# Altium schematic sheet A-Power.SchDoc: Power
size A3; SheetNumber: 03; SheetTotal: 03
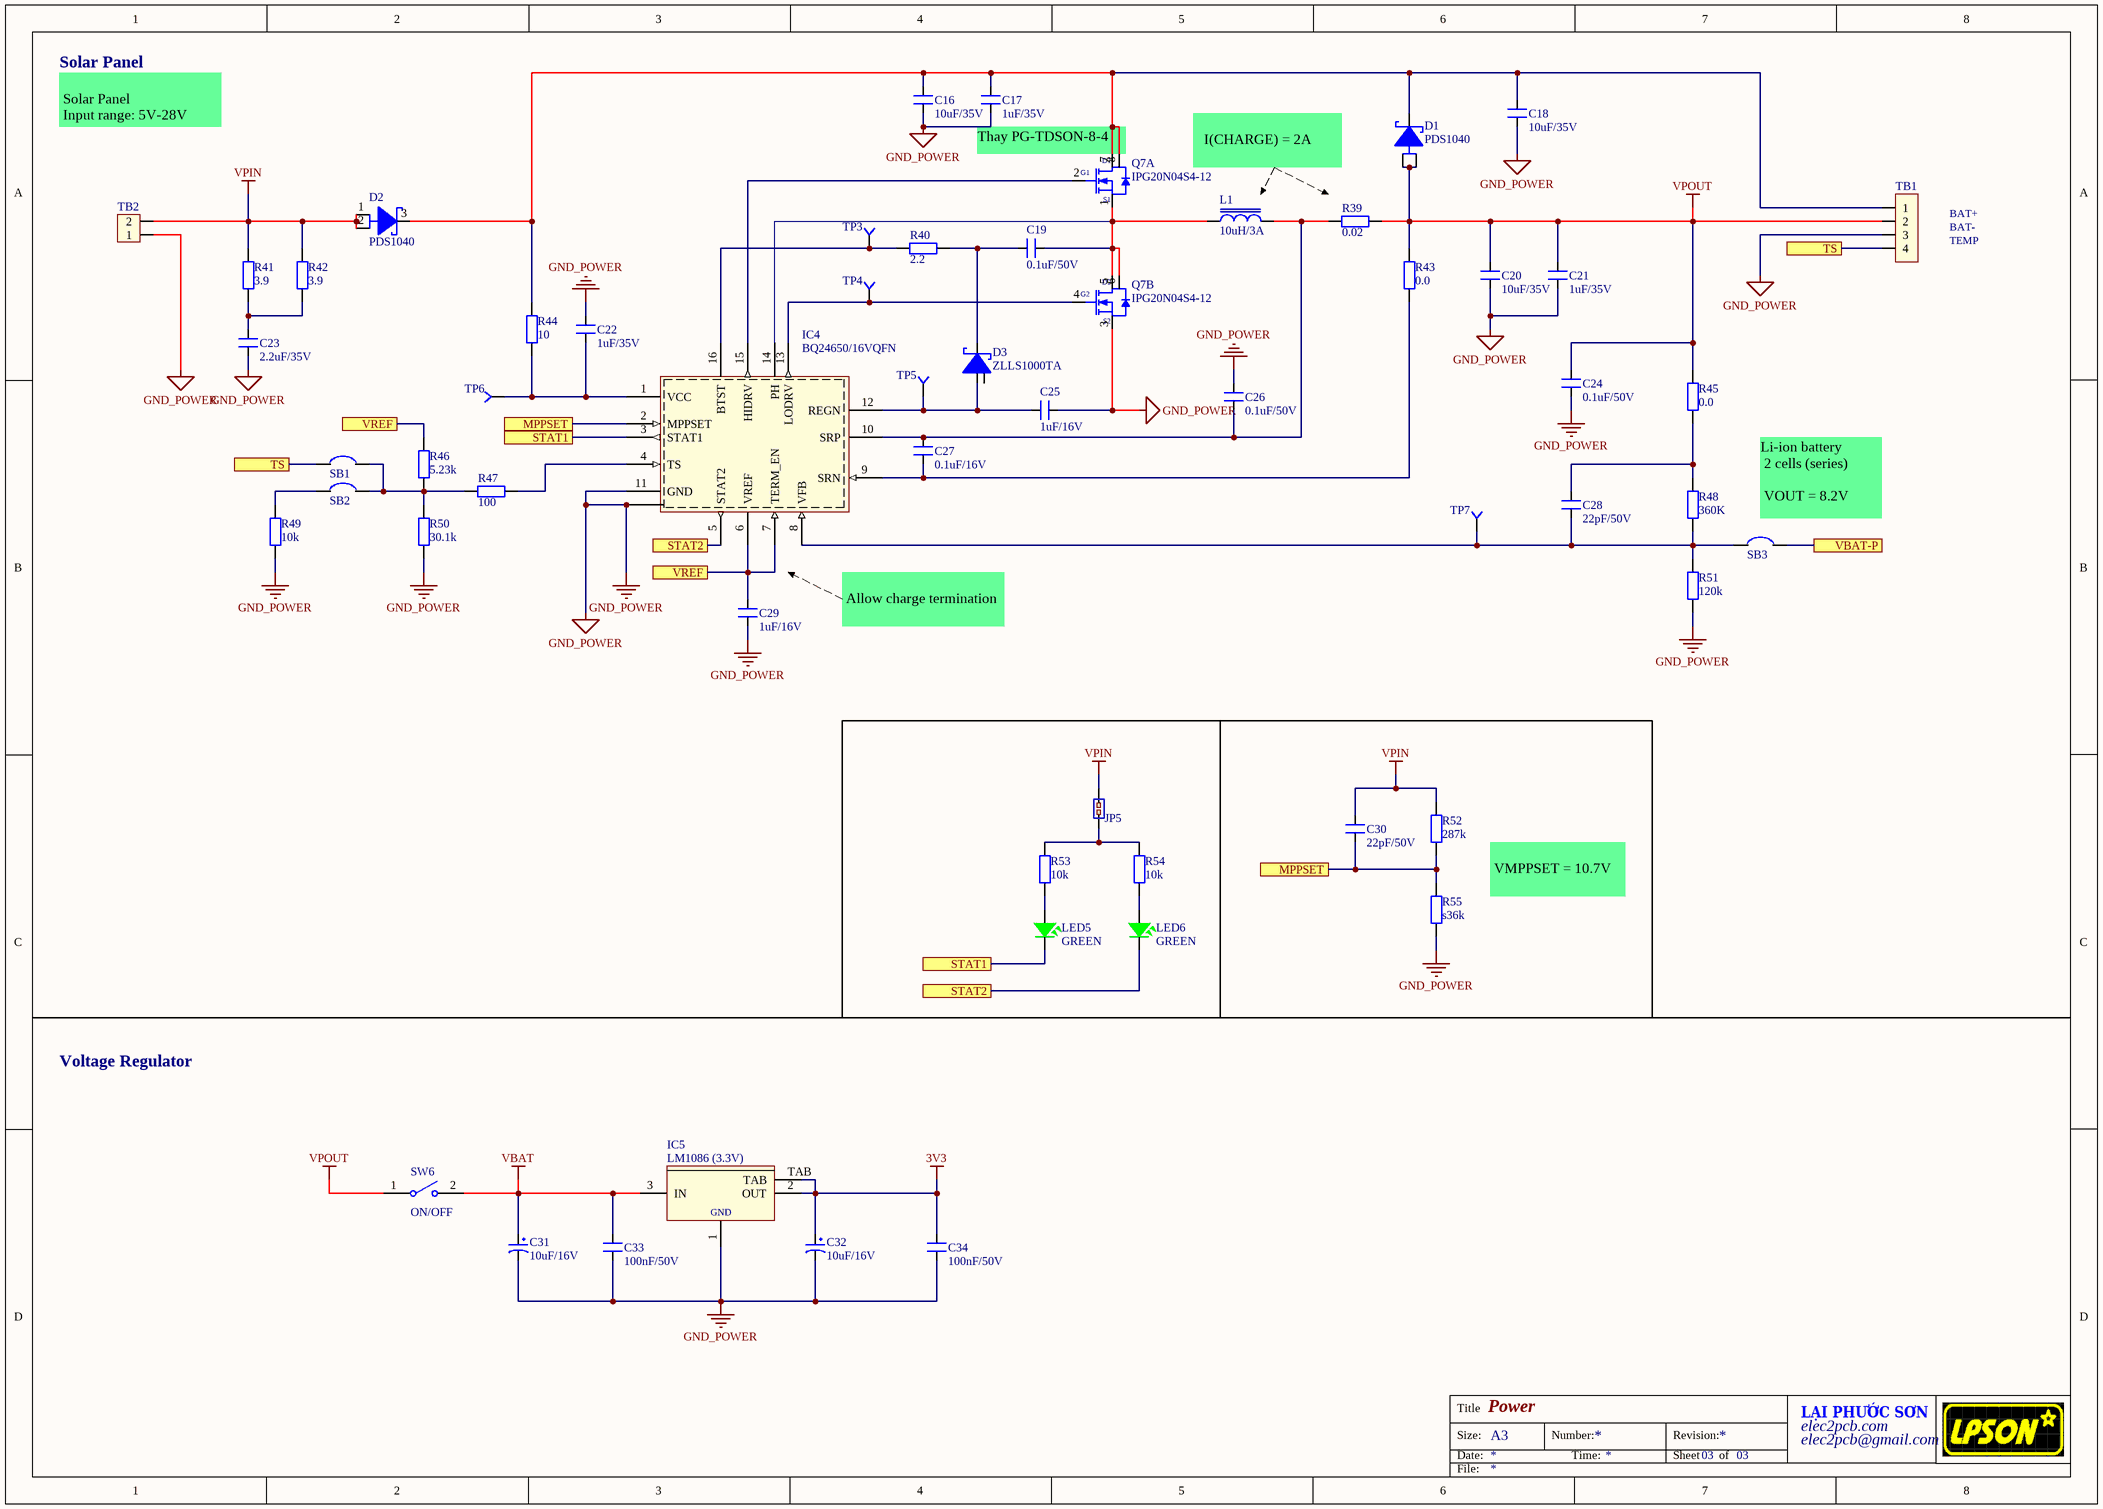
[diagram p0: A-Power.SchDoc]

## Parts
C16  10uF/35V  [CAP_CERA_C3216(CC1206INCH)]
C17  1uF/35V  [CAP_CERA_C2012(CC0805INCH)]
C18  10uF/35V  [CAP_CERA_C3216(CC1206INCH)]
C19  0.1uF/50V  [CAP_CERA_C1608(CC0603INCH)]
C20  10uF/35V  [CAP_CERA_C3216(CC1206INCH)]
C21  1uF/35V  [CAP_CERA_C2012(CC0805INCH)]
C22  1uF/35V  [CAP_CERA_C2012(CC0805INCH)]
C23  2.2uF/35V  [CAP_CERA_C3225(CC1210)]
C24  0.1uF/50V  [CAP_CERA_C1608(CC0603INCH)]
C25  1uF/16V  [CAP_CERA_C2012(CC0805INCH)]
C26  0.1uF/50V  [CAP_CERA_C1608(CC0603INCH)]
C27  0.1uF/16V  [CAP_CERA_C1608(CC0603INCH)]
C28  22pF/50V  [CAP_CERA_C1608(CC0603INCH)]
C29  1uF/16V  [CAP_CERA_C2012(CC0805INCH)]
C30  22pF/50V  [CAP_CERA_C1608(CC0603INCH)]
C31  10uF/16V  [CAP_CERA_C3216(CC1206INCH)]
C32  10uF/16V  [CAP_CERA_C3216(CC1206INCH)]
C33  100nF/50V  [CAP_CERA_C2012(CC0805INCH)]
C34  100nF/50V  [CAP_CERA_C2012(CC0805INCH)]
D1  PDS1040  [PDS1040]
D2  PDS1040  [PDS1040]
D3  ZLLS1000TA  [ZLLS1000]
IC4  BQ24650/16VQFN  [BQ24650-16VQFN]
IC5  LM1086 (3.3V)  [LM1086]
JP5  JP2-ShortingJumper  [Header_2]  (value not drawn)
L1  10uH/3A  [IHLP-2525CZ-01]
LED5  GREEN  [Led 0805G]
LED6  GREEN  [Led 0805G]
Q7  IPG20N04S4-12  [PG-TDSON-8-4]  (parts A,B of 2)
R39  Resistance (Ohms): 0.02  [RES-1206-3216MM]
R40  Resistance (Ohms): 2.2  [RESC2012(0805)]
R41  Resistance (Ohms): 3.9  [RES-1206-3216MM]
R42  Resistance (Ohms): 3.9  [RES-1206-3216MM]
R43  Resistance (Ohms): 0.0  [RESC2012(0805)]
R44  Resistance (Ohms): 10  [RESC2012(0805)]
R45  Resistance (Ohms): 0.0  [RESC2012(0805)]
R46  Resistance (Ohms): 5.23k  [RESC2012(0805)]
R47  Resistance (Ohms): 100  [RESC2012(0805)]
R48  360K  [RESC2012(0805)]
R49  Resistance (Ohms): 10k  [RESC2012(0805)]
R50  Resistance (Ohms): 30.1k  [RESC2012(0805)]
R51  Resistance (Ohms): 120k  [RESC2012(0805)]
R52  Resistance (Ohms): 287k  [RESC2012(0805)]
R53  Resistance (Ohms): 10k  [RESC2012(0805)]
R54  Resistance (Ohms): 10k  [RESC2012(0805)]
R55  Resistance (Ohms): s36k  [RESC2012(0805)]
SB1  Connect  [head PAD]  (value not drawn)
SB2  Connect  [head PAD]  (value not drawn)
SB3  Connect  [head PAD]  (value not drawn)
SW6  ON/OFF  [SW-POWER]
TB1  TERM BLOCK  [MKDS-DOMINO-4-PIN]  (value not drawn)
TB2  TERM BLOCK  [MKDS-DOMINO-2-PIN]  (value not drawn)
TP3  Test Point  [Test_point_VIA06]  (value not drawn)
TP4  Test Point  [Test_point_VIA06]  (value not drawn)
TP5  Test Point  [Test_point_VIA06]  (value not drawn)
TP6  Test Point  [Test_point_VIA06]  (value not drawn)
TP7  Test Point  [Test_point_VIA06]  (value not drawn)

## Ports
MPPSET, STAT1, STAT2, TS, VBAT-P, VREF

## Nets
3V3: C32.1 C34.1 IC5.2(OUT) IC5.TAB
GND_POWER: C16.2 C17.2 C18.2 C20.2 C21.2 C22.2 C23.2 C24.1 C25.1 C26.2 C29.1 C31.2 C32.2 C33.2 C34.2 IC4.11(GND) IC4.PAD IC5.1(GND) Q7.3(S2) R49.2 R50.2 R51.2 R55.1 TB1.3 TB2.1
VBAT: C31.1 C33.1 IC5.3(IN) SW6.2
VPIN: C30.1 D2.1(A1) D2.2(A2) JP5.2 R41.1 R42.1 R52.1 TB2.2
VPOUT: C20.1 C21.1 C24.2 D1.1(A1) D1.2(A2) R39.2 R43.1 R45.1 SW6.1 TB1.2
MPPSET: C30.2 IC4.2(MPPSET) R52.2 R55.2 ; port MPPSET
STAT1: IC4.3(STAT1) LED5.2(K) ; port STAT1
STAT2: IC4.5(STAT2) LED6.2(K) ; port STAT2
TS: SB1.2 TB1.4 ; port TS
VBAT-P: SB3.1 ; port VBAT-P
VREF: C29.2 IC4.6(VREF) IC4.7(TERM_EN) R46.1 ; port VREF
NetC16_1: C16.1 C17.1 C18.1 D1.3(K) D2.3(K) Q7.7(D1) Q7.8(D1) R44.1 TB1.1
NetC19_1: C19.1 D3.3(K) R40.2
NetC19_2: C19.2 IC4.14(PH) L1.1 Q7.1(S1) Q7.5(D2) Q7.6(D2)
NetC22_1: C22.1 IC4.1(VCC) R44.2 TP6.1
NetC23_1: C23.1 R41.2 R42.2
NetC25_2: C25.2 D3.1(A) IC4.12(REGN) TP5.1
NetC26_1: C26.1 C27.1 IC4.10(SRP) L1.2 R39.1
NetC27_2: C27.2 IC4.9(SRN) R43.2
NetC28_1: C28.1 R45.2 R48.2
NetC28_2: C28.2 IC4.8(VFB) R48.1 R51.1 SB3.2 TP7.1
NetIC4_4: IC4.4(TS) R47.2
NetIC4_13: IC4.13(LODRV) Q7.4(G2) TP4.1
NetIC4_15: IC4.15(HIDRV) Q7.2(G1)
NetIC4_16: IC4.16(BTST) R40.1 TP3.1
NetJP5_1: JP5.1 R53.1 R54.1
NetLED5_1: LED5.1(A) R53.2
NetLED6_1: LED6.1(A) R54.2
NetR46_2: R46.2 R47.1 R50.1 SB1.1 SB2.1
NetR49_1: R49.1 SB2.2

Not connected (* = marked no-connect by the designer): D3 NC

## Notes on the sheet
- Solar Panel
- Solar Panel
  Input range: 5V-28V
- Thay PG-TDSON-8-4
- I(CHARGE) = 2A
- BAT+
- BAT-
- TEMP
- (near SB3) Li-ion battery
  2 cells (series)
  VOUT = 8.2V
- Allow charge termination
- VMPPSET = 10.7V
- Voltage Regulator
- Title
- Size:
- Date:
- A3
- Number:
- Time:
- Revision:
- Sheet
- of
- LẠI PHƯỚC SƠN
- elec2pcb@gmail.com
- elec2pcb.com
- File:

## Library data of the parts
C16 C18 C20 = CAP-CER/10uF/35V/X7R-1206: CAP CER 10UF 35V X7R 1206; Manufacturer: Taiyo Yuden; Manufacturer Part Number: GMK316AB7106KL-TR; Capacitance: 10µF; Tolerance: ±10%; Supplier 1: Digi-Key; RoHS: RoHS Compliant; Category: Capacitors; Stock 1: 110595; Pricing 1: 1=0.59, 10=0.49, 50=0.3514, 100=0.3074, 250=0.24156, 500=0.2196, 1000=0.17568 (USD); Packaging: Cut Tape (CT); Voltage - Rated: 35V; Temperature Coefficient: X7R; Mounting Type: Surface Mount, MLCC; Operating Temperature: -55°C ~ 125°C; Applications: General Purpose; Ratings: -; Package / Case: 1206 (3216 Metric); Size / Dimension: 0.126" L x 0.063" W (3.20mm x 1.60mm); Height - Seated (Max): -; Thickness (Max): 0.071" (1.80mm); Lead Spacing: -; Features: -; Lead Style: -; ComponentLink1URL: http://media.digikey.com/pdf/Data%20Sheets/Taiyo%20Yuden%20PDFs%20URL%20links/GMK316AB7106KL-TR_ProdSpec.pdf; ComponentLink1Description: http://media.digikey.com/pdf/Data%20Sheets/Taiyo%20Yuden%20PDFs%20URL%20links/GMK316AB7106KL-TR_ProdSpec.pdf; Supplier Part Number 1: 587-3007-1-ND
C17 C21 C22 = CAP-CER/1uF/35V/X7R/0805: CAP CER 1UF 35V X7R 0805; Manufacturer: Taiyo Yuden; Manufacturer Part Number: GMK212B7105KG-T; Capacitance: 1µF; Tolerance: ±10%; Supplier 1: Digi-Key; RoHS: RoHS Compliant; Category: Capacitors; Stock 1: 129969; Pricing 1: 1=0.42, 10=0.315, 50=0.1838, 100=0.147, 250=0.105, 500=0.0714, 1000=0.05775 (USD); Packaging: Cut Tape (CT); Voltage - Rated: 35V; Temperature Coefficient: X7R; Mounting Type: Surface Mount, MLCC; Operating Temperature: -55°C ~ 125°C; Applications: General Purpose; Ratings: -; Package / Case: 0805 (2012 Metric); Size / Dimension: 0.079" L x 0.049" W (2.00mm x 1.25mm); Height - Seated (Max): -; Thickness (Max): 0.053" (1.35mm); Lead Spacing: -; Features: -; Lead Style: -; ComponentLink1URL: http://ds.yuden.co.jp/TYCOMPAS/ut/detail.do?productNo=GMK212B7105KG-T&fileName=GMK212B7105KG-T_SS&mode=specSheetDownload; ComponentLink1Description: http://ds.yuden.co.jp/TYCOMPAS/ut/detail.do?productNo=GMK212B7105KG-T&fileName=GMK212B7105KG-T_SS&mode=specSheetDownload; Supplier Part Number 1: 587-1438-1-ND
C19 C24 C26 = CAP-CER/0.1uF/50V/X7R/0603: CAP CER 0.1UF 50V X7R 0603; Manufacturer: Kemet; Manufacturer Part Number: C0603X104K5RACTU; Capacitance: 0.10µF; Tolerance: ±10%; Supplier 1: Digi-Key; RoHS: RoHS Compliant; Category: Capacitors; Stock 1: 270785; Pricing 1: 1=0.15, 10=0.1, 50=0.0576, 100=0.0475, 250=0.04, 500=0.0335, 1000=0.0275 (USD); Packaging: Cut Tape (CT); Voltage - Rated: 50V; Temperature Coefficient: X7R; Mounting Type: Surface Mount, MLCC; Operating Temperature: -55°C ~ 125°C; Applications: Boardflex Sensitive; Ratings: -; Package / Case: 0603 (1608 Metric); Size / Dimension: 0.063" L x 0.031" W (1.60mm x 0.80mm); Height - Seated (Max): -; Thickness (Max): 0.034" (0.87mm); Lead Spacing: -; Features: Soft Termination; Lead Style: -; ComponentLink1URL: http://www.kemet.com/docfinder?Partnumber=C0603X104K5RACTU; ComponentLink1Description: http://www.kemet.com/docfinder?Partnumber=C0603X104K5RACTU; Supplier Part Number 1: 399-7969-1-ND
C23 = CAP-CER/2.2uF/35V/X7R/1210: CAP CER 2.2UF 35V X7R 1210; Manufacturer: Taiyo Yuden; Manufacturer Part Number: GMK325B7225KNHT; Capacitance: 2.2µF; Tolerance: ±10%; Supplier 1: Digi-Key; RoHS: RoHS Compliant; Category: Capacitors; Stock 1: 3771; Pricing 1: 1=0.71, 10=0.561, 50=0.4056, 100=0.338, 250=0.25352, 500=0.21632, 1000=0.169 (USD); Packaging: Cut Tape (CT); Voltage - Rated: 35V; Temperature Coefficient: X7R; Mounting Type: Surface Mount, MLCC; Operating Temperature: -55°C ~ 125°C; Applications: Automotive; Ratings: AEC-Q200; Package / Case: 1210 (3225 Metric); Size / Dimension: 0.126" L x 0.098" W (3.20mm x 2.50mm); Height - Seated (Max): -; Thickness (Max): 0.083" (2.10mm); Lead Spacing: -; Features: -; Lead Style: -; ComponentLink1URL: http://ds.yuden.co.jp/TYCOMPAS/ut/detail.do?productNo=GMK325B7225KNHT&fileName=GMK325B7225KNHT_SS&mode=specSheetDownload; ComponentLink1Description: http://ds.yuden.co.jp/TYCOMPAS/ut/detail.do?productNo=GMK325B7225KNHT&fileName=GMK325B7225KNHT_SS&mode=specSheetDownload; Supplier Part Number 1: 587-3720-1-ND
C25 C29 = CAP-CER/1uF/16V/X7R/0805: CAP CER 1UF 16V X7R 0805; Manufacturer: Kemet; Manufacturer Part Number: C0805C105K4RACTU; Capacitance: 1µF; Tolerance: ±10%; Supplier 1: Digi-Key; RoHS: RoHS Compliant; Category: Capacitors; Stock 1: 546343; Pricing 1: 1=0.12, 10=0.089, 50=0.0482, 100=0.0407, 250=0.03332, 500=0.0285, 1000=0.0222 (USD); Packaging: Cut Tape (CT); Voltage - Rated: 16V; Temperature Coefficient: X7R; Mounting Type: Surface Mount, MLCC; Operating Temperature: -55°C ~ 125°C; Applications: General Purpose; Ratings: -; Package / Case: 0805 (2012 Metric); Size / Dimension: 0.079" L x 0.049" W (2.00mm x 1.25mm); Height - Seated (Max): -; Thickness (Max): 0.039" (1.00mm); Lead Spacing: -; Features: Low ESL; Lead Style: -; ComponentLink1URL: http://www.kemet.com/docfinder?Partnumber=C0805C105K4RACTU; ComponentLink1Description: http://www.kemet.com/docfinder?Partnumber=C0805C105K4RACTU; Supplier Part Number 1: 399-1284-1-ND
C27 = CAP-CER/0.1uF/16V/X7R/0603: CAP CER 0.1UF 16V X7R 0603; Manufacturer: Yageo; Manufacturer Part Number: CC0603KRX7R7BB104; Capacitance: 0.1µF; Tolerance: ±10%; Supplier 1: Digi-Key; Supplier Part Number 1: 311-1088-1-ND; Stock: 601138; Pricing: 1=0.1, 10=0.018, 25=0.0124, 100=0.0081, 250=0.00668, 500=0.0057, 1000=0.00444 (USD); Packaging: Cut Tape (CT); Voltage - Rated: 16V; Temperature Coefficient: X7R; Mounting Type: Surface Mount, MLCC; Operating Temperature: -55°C ~ 125°C; Applications: General Purpose; Ratings: -; Package / Case: 0603 (1608 Metric); Size / Dimension: 0.063" L x 0.031" W (1.60mm x 0.80mm); Height - Seated (Max): -; Thickness (Max): 0.035" (0.90mm); Lead Spacing: -; Features: -; Lead Style: -; ComponentLink1URL: http://www.yageo.com/documents/recent/UPY-GPHC_X7R_6.3V-to-50V-v12.pdf; ComponentLink1Description: http://www.yageo.com/documents/recent/UPY-GPHC_X7R_6.3V-to-50V-v12.pdf
C28 C30 = CAP-CER/22pF/50V/X7R/0603: CAP CER 22PF 50V X7R 0603; Manufacturer: AVX Corporation; Manufacturer Part Number: 06035C220JAT2A; Tolerance: ±5%; Supplier 1: Digi-Key; RoHS: RoHS Compliant; Category: Capacitors; Stock 1: 58619; Pricing 1: 1=0.18, 10=0.124, 100=0.063, 250=0.051, 500=0.045, 1000=0.03825 (USD); Packaging: Cut Tape (CT); Capacitance: 22pF; Voltage - Rated: 50V; Temperature Coefficient: X7R; Mounting Type: Surface Mount, MLCC; Operating Temperature: -55°C ~ 125°C; Applications: General Purpose; Ratings: -; Package / Case: 0603 (1608 Metric); Size / Dimension: 0.063" L x 0.032" W (1.60mm x 0.81mm); Height - Seated (Max): -; Thickness (Max): 0.035" (0.90mm); Lead Spacing: -; Features: -; Lead Style: -; ComponentLink1URL: http://datasheets.avx.com/X7RDielectric.pdf; ComponentLink1Description: http://datasheets.avx.com/X7RDielectric.pdf; Supplier Part Number 1: 478-6204-1-ND
C31 C32 = CAP-TANT/10uF/16V/1206: CAP TANT 10UF 16V 10% 1206; Manufacturer: Kemet; Manufacturer Part Number: T491A106K016AT; Manufacturer Size Code: A; Capacitance: 10µF; ESR (Equivalent Series Resistance): 7 Ohm; Type: Molded; Lifetime @ Temp.: 2000 Hrs @ 85°C; Supplier 1: Digi-Key; Supplier Part Number 1: 399-8269-1-ND; Stock: 94914; Pricing: 1=0.42, 10=0.369, 25=0.2636, 50=0.2242, 100=0.1846, 250=0.14764, 1000=0.11891 (USD); Packaging: Cut Tape (CT); Tolerance: ±10%; Voltage - Rated: 16V; Operating Temperature: -55°C ~ 125°C; Mounting Type: Surface Mount; Package / Case: 1206 (3216 Metric); Size / Dimension: 0.126" L x 0.063" W (3.20mm x 1.60mm); Height - Seated (Max): 0.071" (1.80mm); Lead Spacing: -; Features: General Purpose; ComponentLink1URL: http://www.kemet.com/Lists/ProductCatalog/Attachments/254/KEM_T2005_T491.pdf; ComponentLink1Description: http://www.kemet.com/Lists/ProductCatalog/Attachments/254/KEM_T2005_T491.pdf
C33 C34 = CAP-CER/100nF/50V/X7R-0805: CAP CER 0.1UF 50V X7R 0805; Manufacturer: AVX Corporation; Manufacturer Part Number: 08055C104KAT2A; Capacitance: 0.10µF; Tolerance: ±10%; Supplier 1: Digi-Key; RoHS: RoHS Compliant; Category: Capacitors; Stock 1: 6127704; Pricing 1: 1=0.1, 10=0.036, 100=0.0165, 250=0.01352, 500=0.01156, 1000=0.009 (USD); Packaging: Cut Tape (CT); Voltage - Rated: 50V; Temperature Coefficient: X7R; Mounting Type: Surface Mount, MLCC; Operating Temperature: -55°C ~ 125°C; Applications: General Purpose; Ratings: -; Package / Case: 0805 (2012 Metric); Size / Dimension: 0.079" L x 0.049" W (2.01mm x 1.25mm); Height - Seated (Max): -; Thickness (Max): 0.037" (0.94mm); Lead Spacing: -; Features: -; Lead Style: -; ComponentLink1URL: http://datasheets.avx.com/X7RDielectric.pdf; ComponentLink1Description: http://datasheets.avx.com/X7RDielectric.pdf; Supplier Part Number 1: 478-1395-1-ND
D1 D2 = DIODE-PDS1040/POWERDI5: DIODE SCHOTTKY 40V 10A POWERDI5; Manufacturer: Diodes Incorporated; Manufacturer Part Number: PDS1040-13; Voltage - Forward (Vf) (Max) @ If: 510mV @ 10A; Speed: Fast Recovery =< 500ns, > 200mA (Io); Current - Reverse Leakage @ Vr: 700µA @ 40V; Supplier 1: Digi-Key; RoHS: RoHS Compliant; Category: Discrete Semiconductor Products; Stock 1: 55164; Pricing 1: 1=1.19, 10=1.064, 100=0.8295, 500=0.686, 1000=0.5425 (USD); Packaging: Cut Tape (CT); Diode Type: Schottky; Voltage - DC Reverse (Vr) (Max): 40V; Current - Average Rectified (Io): 10A; Reverse Recovery Time (trr): -; Capacitance @ Vr, F: -; Mounting Type: Surface Mount; Package / Case: PowerDI™ 5; Supplier Device Package: PowerDI™ 5; Operating Temperature - Junction: -65°C ~ 150°C; ComponentLink1URL: http://www.diodes.com/_files/datasheets/ds30538.pdf; ComponentLink1Description: http://www.diodes.com/_files/datasheets/ds30538.pdf; Supplier Part Number 1: PDS1040DICT-ND
D3 = DIODE-ZLLS1000TA/SOT23-3: DIODE SCHOTTKY 40V 1.16A SOT23-3; Manufacturer: Diodes Incorporated; Current - Average Rectified (Io): 1.16A (DC); Voltage - Forward (Vf) (Max) @ If: 560mV @ 1A; Speed: Fast Recovery =< 500ns, > 200mA (Io); Reverse Recovery Time (trr): 5ns; Current - Reverse Leakage @ Vr: 20µA @ 30V; Capacitance @ Vr, F: 28pF @ 30V, 1MHz; Supplier 1: Digi-Key; Manufacturer Part Number: ZLLS1000TA; RoHS: RoHS Compliant; Category: Discrete Semiconductor Products; Stock 1: 42831; Pricing 1: 1=0.59, 10=0.503, 100=0.3757, 500=0.2951, 1000=0.2275 (USD); Packaging: Cut Tape (CT); Diode Type: Schottky; Voltage - DC Reverse (Vr) (Max): 40V; Mounting Type: Surface Mount; Package / Case: TO-236-3, SC-59, SOT-23-3; Supplier Device Package: SOT-23-3; Operating Temperature - Junction: 150°C (Max); ComponentLink1URL: http://www.diodes.com/_files/datasheets/ZLLS1000.pdf; ComponentLink1Description: http://www.diodes.com/_files/datasheets/ZLLS1000.pdf; Supplier Part Number 1: ZLLS1000CT-ND
IC4 = BQ24650/16VQFN: IC SYNC SW-MODE BAT CHRGR 16VQFN; Manufacturer: Texas Instruments; Manufacturer Part Number: BQ24650RVAT; Battery Chemistry: Multi-Chemistry; Programmable Features: Current; Fault Protection: Over Temperature, Over Voltage; Voltage - Supply (Max): 28V; Supplier 1: Digi-Key; RoHS: RoHS Compliant; Category: Integrated Circuits (ICs); Stock 1: 595; Pricing 1: 1=5.65, 10=5.072, 100=4.1607 (USD); Packaging: Cut Tape (CT); Number of Cells: -; Current - Charging: -; Charge Current - Max: -; Battery Pack Voltage: -; Interface: -; Operating Temperature: -40°C ~ 85°C (TA); Package / Case: 16-VFQFN Exposed Pad; Supplier Device Package: 16-VQFN Exposed Pad (3.5x3.5); ComponentLink1URL: http://www.ti.com/lit/ds/symlink/bq24650.pdf; ComponentLink1Description: http://www.ti.com/lit/ds/symlink/bq24650.pdf; Supplier Part Number 1: 296-27699-1-ND
IC5 = LM1086CS-3.3/NOPB: IC REG LDO 3.3V 1.5A DDPAK; Manufacturer: Texas Instruments; Regulator Topology: Positive Fixed; Voltage - Dropout (Typical): 1.3V @ 1.5A; Number of Regulators: 1; Voltage - Input: Up to 27V; Supplier 1: Digi-Key; Manufacturer Part Number: LM1086CS-3.3/NOPB; RoHS: RoHS Compliant By Exemption; Category: Integrated Circuits (ICs); Stock 1: 1672; Pricing 1: 1=2.01, 10=1.802, 100=1.4484, 500=1.19, 1000=0.85 (USD); Packaging: Tube; Voltage - Output: 3.3V; Current - Output: 1.5A; Current - Limit (Min): 1.5A; Operating Temperature: 0°C ~ 125°C; Mounting Type: Surface Mount; Package / Case: TO-263-4, D²Pak (3 Leads + Tab), TO-263AA; Supplier Device Package: DDPAK/TO-263-3; ComponentLink1URL: http://www.ti.com/lit/ds/symlink/lm1086.pdf; ComponentLink1Description: http://www.ti.com/lit/ds/symlink/lm1086.pdf; Supplier Part Number 1: LM1086CS-3.3/NOPB-ND
JP5 = JP2-ShortingJumper: 2.54mm 2-Pin Shorting Jumper; Value: Shorting Jumper; Supplier Link: http://tme.vn/Product.aspx?id=509#page=pro_info
L1 = IND-10uH/3A/105mOHM: FIXED IND 10UH 3A 105mOHM SMD; Manufacturer: Vishay Dale; Manufacturer Part Number: IHLP2525CZER100M01; Type: Molded; Inductance: 10µH; Tolerance: ±20%; Current - Saturation: 7A; Shielding: Shielded; DC Resistance (DCR): 105 mOhm Max; Frequency - Test: 100kHz; Supplier 1: Digi-Key; RoHS: RoHS Compliant; Category: Inductors, Coils, Chokes; Stock 1: 10620; Pricing 1: 1=2.74, 10=2.555, 25=2.3724, 50=2.0806, 100=1.898, 250=1.679, 500=1.606, 1000=1.4965 (USD); Packaging: Cut Tape (CT); Material - Core: -; Current Rating: 3A; Q @ Freq: -; Frequency - Self Resonant: -; Ratings: -; Operating Temperature: -55°C ~ 125°C; Mounting Type: Surface Mount; Package / Case: Nonstandard; Size / Dimension: 0.270" L x 0.255" W (6.86mm x 6.47mm); Height - Seated (Max): 0.118" (3.00mm); ComponentLink1URL: http://www.vishay.com/docs/34104/lp25cz01.pdf; ComponentLink1Description: http://www.vishay.com/docs/34104/lp25cz01.pdf; Supplier Part Number 1: 541-1013-1-ND
LED5 LED6 = LED-GREEN/CLEAR/0805: LED GREEN CLEAR 0805 SMD; Manufacturer: Lite-On Inc.; Manufacturer Part Number: LTST-C171GKT; Wavelength - Dominant: 569nm; Wavelength - Peak: 565nm; Millicandela Rating: 12mcd; Voltage - Forward (Vf) (Typ): 2.1V; Current - Test: 20mA; Viewing Angle: 130°; Lens Color: Colorless; Lens Style/Size: Rectangle with Flat Top, 1.40mm x 1.25mm; Supplier 1: Digi-Key; Supplier Part Number 1: 160-1423-1-ND; Stock: 159350; Pricing: 1=0.25, 10=0.2, 100=0.1091, 250=0.07272, 500=0.06182, 1000=0.04727 (USD); Packaging: Cut Tape (CT); Color: Green; Lens Transparency: Clear; Package / Case: 0805 (2012 Metric); Supplier Device Package: Chip LED; Size / Dimension: 2.00mm L x 1.25mm W; Height (Max): 0.80mm; Mounting Type: Surface Mount; ComponentLink1URL: http://media.digikey.com/pdf/Data%20Sheets/Lite-On%20PDFs/LTST-C171GKT.pdf; ComponentLink1Description: http://media.digikey.com/pdf/Data%20Sheets/Lite-On%20PDFs/LTST-C171GKT.pdf
Q7 = MOSFET-IPG20N04S4/TDSON8: MOSFE,T 2N-CH, 40V 20A TDSON-8 OptiMOS-T2; Manufacturer: Infineon; FET Type: 2 N-Channel (Dual); FET Feature: Standard; Rds On (Max) @ Id, Vgs: 12.2 mOhms; Vgs(th) (Max) @ Id: 20 V; Supplier 1: Mouser; Manufacturer Part Number: IPG20N04S4-12; RoHS: RoHS Compliant; Category: Discrete Semiconductor Products; Stock 1: 0; Pricing 1: *; Packaging: Cut Tape (CT); Drain to Source Voltage (Vdss): 40V; Current - Continuous Drain (Id) @ 25°C: 20A; Gate Charge (Qg) @ Vgs: *; Input Capacitance (Ciss) @ Vds: *; Power - Max: *; Operating Temperature: -55°C ~ 150°C (TJ); Mounting Type: Surface Mount; Package / Case: TDSON-8; Supplier Device Package: TDSON-8; ComponentLink1URL: http://www.mouser.com/ds/2/196/Infineon-IPG20N04S4_12-DS-v01_00-en-785417.pdf; ComponentLink1Description: http://www.mouser.com/ds/2/196/Infineon-IPG20N04S4_12-DS-v01_00-en-785417.pdf; Supplier Part Number 1: 726-IPG20N04S4-12
R39 = RES-1206/±1%: RES SMD 0.02 OHM 1% 1W 1206; Manufacturer: Vishay Dale; Manufacturer Part Number: WSLP1206R0200FEA; Temperature Coefficient: ±75ppm/°C; Supplier 1: Digi-Key; Supplier Part Number 1: WSLP-.02CT-ND; RoHS: RoHS Compliant; Category: Resistors; Stock 1: 12757; Pricing 1: 1=0.84, 10=0.726, 25=0.638, 50=0.583, 100=0.506, 250=0.44, 500=0.3652, 1000=0.297 (USD); Packaging: Cut Tape (CT); Tolerance: ±1%; Power (Watts): 1W; Composition: Metal Element; Features: Current Sense, Moisture Resistant, Pulse Withstanding; Operating Temperature: -65°C ~ 170°C; Package / Case: 1206 (3216 Metric); Supplier Device Package: 1206; Size / Dimension: 0.126" L x 0.063" W (3.20mm x 1.60mm); Height: 0.035" (0.89mm); Number of Terminations: 2; ComponentLink1URL: http://www.vishay.com/docs/30122/wslp.pdf; ComponentLink1Description: http://www.vishay.com/docs/30122/wslp.pdf
R40 = RES-0805/±5%: RES SMD 2.2 OHM 5% 1/8W 0805; Manufacturer: Panasonic Electronic Components; Manufacturer Part Number: ERJ-6GEYJ2R2V; Power (Watts): 0.125W, 1/8W; Temperature Coefficient: -100/ +600ppm/°C; Supplier 1: Digi-Key; Supplier Part Number 1: P2.2ACT-ND; RoHS: RoHS Compliant; Category: Resistors; Stock 1: 96175; Pricing 1: 1=0.1, 50=0.015, 100=0.011, 250=0.0084, 500=0.00674, 1000=0.00496 (USD); Packaging: Cut Tape (CT); Tolerance: ±5%; Composition: Thick Film; Features: Automotive AEC-Q200; Operating Temperature: -55°C ~ 155°C; Package / Case: 0805 (2012 Metric); Supplier Device Package: 0805; Size / Dimension: 0.079" L x 0.049" W (2.00mm x 1.25mm); Height: 0.028" (0.70mm); Number of Terminations: 2; ComponentLink1URL: http://industrial.panasonic.com/www-cgi/jvcr13pz.cgi?E+PZ+3+AOA0001+ERJ6GEYJ2R2V+7+WW; ComponentLink1Description: http://industrial.panasonic.com/www-cgi/jvcr13pz.cgi?E+PZ+3+AOA0001+ERJ6GEYJ2R2V+7+WW
R41 R42 = RES-1206/±5%: RES SMD 3.9 OHM 1% 1/4W 1206; Manufacturer: Panasonic Electronic Components; Manufacturer Part Number: ERJ-8RQF3R9V; Power (Watts): 0.25W, 1/4W; Temperature Coefficient: ±200ppm/°C; Supplier 1: Digi-Key; Supplier Part Number 1: P3.9RCT-ND; RoHS: RoHS Compliant; Category: Resistors; Stock 1: 14305; Pricing 1: 1=0.54, 50=0.21, 100=0.1688, 250=0.13124, 500=0.099, 1000=0.0765 (USD); Packaging: Cut Tape (CT); Tolerance: ±1%; Composition: Thick Film; Features: Automotive AEC-Q200, Current Sense; Operating Temperature: -55°C ~ 125°C; Package / Case: 1206 (3216 Metric); Supplier Device Package: 1206; Size / Dimension: 0.126" L x 0.063" W (3.20mm x 1.60mm); Height: 0.028" (0.70mm); Number of Terminations: 2; ComponentLink1URL: https://industrial.panasonic.com/cdbs/www-data/pdf/RDA0000/AOA0000C239.pdf; ComponentLink1Description: https://industrial.panasonic.com/cdbs/www-data/pdf/RDA0000/AOA0000C239.pdf
R43 R45 = RES-0805/±5%: RES SMD 0.0 OHM JUMPER 1/8W 0805; Manufacturer: Yageo; Manufacturer Part Number: RC0805JR-070RL; Power (Watts): 0.125W, 1/8W; Supplier 1: Digi-Key; Supplier Part Number 1: 311-0.0ARCT-ND; RoHS: RoHS Compliant; Category: Resistors; Stock 1: 1149948; Pricing 1: 1=0.1, 10=0.018, 25=0.0128, 100=0.0073, 250=0.00556, 500=0.00444, 1000=0.00326, 2500=0.00283 (USD); Packaging: Cut Tape (CT); Tolerance: Jumper; Composition: Thick Film; Features: Moisture Resistant; Temperature Coefficient: -; Operating Temperature: -55°C ~ 155°C; Package / Case: 0805 (2012 Metric); Supplier Device Package: 0805; Size / Dimension: 0.079" L x 0.049" W (2.00mm x 1.25mm); Height: 0.024" (0.60mm); Number of Terminations: 2; ComponentLink1URL: http://www.yageo.com/documents/recent/PYu-RC_Group_51_RoHS_L_04.pdf; ComponentLink1Description: http://www.yageo.com/documents/recent/PYu-RC_Group_51_RoHS_L_04.pdf
R44 = RES-0805/±5%: RES SMD 10 OHM 5% 1/8W 0805; Manufacturer: Yageo; Manufacturer Part Number: RC0805JR-0710RL; Power (Watts): 0.125W, 1/8W; Temperature Coefficient: ±200ppm/°C; Supplier 1: Digi-Key; Supplier Part Number 1: 311-10ARCT-ND; RoHS: RoHS Compliant; Category: Resistors; Stock 1: 465662; Pricing 1: 1=0.1, 10=0.018, 25=0.0128, 100=0.0073, 250=0.00556, 500=0.00444, 1000=0.00326, 2500=0.00283 (USD); Packaging: Cut Tape (CT); Tolerance: ±5%; Composition: Thick Film; Features: Moisture Resistant; Operating Temperature: -55°C ~ 155°C; Package / Case: 0805 (2012 Metric); Supplier Device Package: 0805; Size / Dimension: 0.079" L x 0.049" W (2.00mm x 1.25mm); Height: 0.024" (0.60mm); Number of Terminations: 2; ComponentLink1URL: http://www.yageo.com/documents/recent/PYu-RC_Group_51_RoHS_L_04.pdf; ComponentLink1Description: http://www.yageo.com/documents/recent/PYu-RC_Group_51_RoHS_L_04.pdf
R46 = RES-0805/±1%: RES SMD 5.23K OHM 1% 1/8W 0805; Manufacturer: Panasonic Electronic Components; Manufacturer Part Number: ERJ-6ENF5231V; Power (Watts): 0.125W, 1/8W; Temperature Coefficient: ±100ppm/°C; Supplier 1: Digi-Key; Supplier Part Number 1: P5.23KCCT-ND; RoHS: RoHS Compliant; Category: Resistors; Stock 1: 32701; Pricing 1: 1=0.1, 50=0.022, 100=0.0162, 250=0.01236, 500=0.0099, 1000=0.00729 (USD); Packaging: Cut Tape (CT); Tolerance: ±1%; Composition: Thick Film; Features: Automotive AEC-Q200; Operating Temperature: -55°C ~ 155°C; Package / Case: 0805 (2012 Metric); Supplier Device Package: 0805; Size / Dimension: 0.079" L x 0.049" W (2.00mm x 1.25mm); Height: 0.028" (0.70mm); Number of Terminations: 2; ComponentLink1URL: http://industrial.panasonic.com/www-cgi/jvcr13pz.cgi?E+PZ+3+AOA0002+ERJ6ENF5231V+7+WW; ComponentLink1Description: http://industrial.panasonic.com/www-cgi/jvcr13pz.cgi?E+PZ+3+AOA0002+ERJ6ENF5231V+7+WW
R47 = RES-0805/±5%: RES SMD 100 OHM 5% 1/8W 0805; Manufacturer: Panasonic Electronic Components; Manufacturer Part Number: ERJ-6GEYJ101V; Power (Watts): 0.125W, 1/8W; Temperature Coefficient: ±200ppm/°C; Supplier 1: Digi-Key; Supplier Part Number 1: P100ACT-ND; RoHS: RoHS Compliant; Category: Resistors; Stock 1: 653175; Pricing 1: 1=0.1, 50=0.015, 100=0.011, 250=0.0084, 500=0.00674, 1000=0.00496 (USD); Packaging: Cut Tape (CT); Tolerance: ±5%; Composition: Thick Film; Features: Automotive AEC-Q200; Operating Temperature: -55°C ~ 155°C; Package / Case: 0805 (2012 Metric); Supplier Device Package: 0805; Size / Dimension: 0.079" L x 0.049" W (2.00mm x 1.25mm); Height: 0.028" (0.70mm); Number of Terminations: 2; ComponentLink1URL: http://industrial.panasonic.com/www-cgi/jvcr13pz.cgi?E+PZ+3+AOA0001+ERJ6GEYJ101V+7+WW; ComponentLink1Description: http://industrial.panasonic.com/www-cgi/jvcr13pz.cgi?E+PZ+3+AOA0001+ERJ6GEYJ101V+7+WW
R48 = RES-0805/±1%: RES SMD 360K OHM 1% 1/8W 0805; Manufacturer: Yageo; Manufacturer Part Number: RC0805FR-07360KL; Power (Watts): 0.125W, 1/8W; Temperature Coefficient: ±100ppm/°C; Supplier 1: Digi-Key; Supplier Part Number 1: 311-360KCRCT-ND; RoHS: RoHS Compliant; Category: Resistors; Stock 1: 32090; Pricing 1: 1=0.1, 10=0.021, 25=0.0152, 100=0.0084, 250=0.00644, 500=0.00514, 1000=0.00379, 2500=0.00329 (USD); Packaging: Cut Tape (CT); Resistance (Ohms): 360k; Tolerance: ±1%; Composition: Thick Film; Features: Moisture Resistant; Operating Temperature: -55°C ~ 155°C; Package / Case: 0805 (2012 Metric); Supplier Device Package: 0805; Size / Dimension: 0.079" L x 0.049" W (2.00mm x 1.25mm); Height: 0.024" (0.60mm); Number of Terminations: 2; ComponentLink1URL: http://www.yageo.com/documents/recent/PYu-RC_Group_51_RoHS_L_04.pdf; ComponentLink1Description: http://www.yageo.com/documents/recent/PYu-RC_Group_51_RoHS_L_04.pdf
R49 R53 R54 = RES-0805/±5%: RES SMD 10K OHM 5% 1/8W 0805; Manufacturer: Yageo; Manufacturer Part Number: RC0805JR-0710KL; Power (Watts): 0.125W, 1/8W; Temperature Coefficient: ±100ppm/°C; Supplier 1: Digi-Key; Supplier Part Number 1: 311-10KARCT-ND; RoHS: RoHS Compliant; Category: Resistors; Stock 1: 1117583; Pricing 1: 1=0.1, 10=0.018, 25=0.0128, 100=0.0073, 250=0.00556, 500=0.00444, 1000=0.00326, 2500=0.00283 (USD); Packaging: Cut Tape (CT); Tolerance: ±5%; Composition: Thick Film; Features: Moisture Resistant; Operating Temperature: -55°C ~ 155°C; Package / Case: 0805 (2012 Metric); Supplier Device Package: 0805; Size / Dimension: 0.079" L x 0.049" W (2.00mm x 1.25mm); Height: 0.024" (0.60mm); Number of Terminations: 2; ComponentLink1URL: http://www.yageo.com/documents/recent/PYu-RC_Group_51_RoHS_L_04.pdf; ComponentLink1Description: http://www.yageo.com/documents/recent/PYu-RC_Group_51_RoHS_L_04.pdf
R50 = RES-0805/±1%: RES SMD 30.1K OHM 1% 1/8W 0805; Manufacturer: Yageo; Manufacturer Part Number: RC0805FR-0730K1L; Power (Watts): 0.125W, 1/8W; Temperature Coefficient: ±100ppm/°C; Supplier 1: Digi-Key; Supplier Part Number 1: 311-30.1KCRCT-ND; RoHS: RoHS Compliant; Category: Resistors; Stock 1: 225333; Pricing 1: 1=0.1, 10=0.021, 25=0.0152, 100=0.0084, 250=0.00644, 500=0.00514, 1000=0.00379, 2500=0.00329 (USD); Packaging: Cut Tape (CT); Tolerance: ±1%; Composition: Thick Film; Features: Moisture Resistant; Operating Temperature: -55°C ~ 155°C; Package / Case: 0805 (2012 Metric); Supplier Device Package: 0805; Size / Dimension: 0.079" L x 0.049" W (2.00mm x 1.25mm); Height: 0.024" (0.60mm); Number of Terminations: 2; ComponentLink1URL: http://www.yageo.com/documents/recent/PYu-RC_Group_51_RoHS_L_04.pdf; ComponentLink1Description: http://www.yageo.com/documents/recent/PYu-RC_Group_51_RoHS_L_04.pdf
R51 = RES-0805/±1%: RES SMD 120K OHM 1% 1/8W 0805; Manufacturer: Yageo; Manufacturer Part Number: RC0805FR-07120KL; Power (Watts): 0.125W, 1/8W; Temperature Coefficient: ±100ppm/°C; Datasheet: *; Supplier: *; Package: 0805; Supplier VN: *; Supplier 1: Digi-Key; Supplier Part Number 1: 311-120KCRCT-ND; RoHS: RoHS Compliant; Category: Resistors; Stock 1: 290600; Pricing 1: 1=0.1, 10=0.021, 25=0.0152, 100=0.0084, 250=0.00644, 500=0.00514, 1000=0.00379, 2500=0.00329 (USD); Packaging: Cut Tape (CT); Tolerance: ±1%; Composition: Thick Film; Features: Moisture Resistant; Operating Temperature: -55°C ~ 155°C; Package / Case: 0805 (2012 Metric); Supplier Device Package: 0805; Size / Dimension: 0.079" L x 0.049" W (2.00mm x 1.25mm); Height: 0.024" (0.60mm); Number of Terminations: 2; ComponentLink1URL: http://www.yageo.com/documents/recent/PYu-RC_Group_51_RoHS_L_04.pdf; ComponentLink1Description: http://www.yageo.com/documents/recent/PYu-RC_Group_51_RoHS_L_04.pdf
R52 = RES-0805/±1%: RES SMD 287K OHM 1% 1/8W 0805; Manufacturer: Panasonic Electronic Components; Manufacturer Part Number: ERJ-6ENF2873V; Power (Watts): 0.125W, 1/8W; Temperature Coefficient: ±100ppm/°C; Supplier 1: Digi-Key; Supplier Part Number 1: P287KCCT-ND; RoHS: RoHS Compliant; Category: Resistors; Stock 1: 50879; Pricing 1: 1=0.1, 50=0.022, 100=0.0162, 250=0.01236, 500=0.0099, 1000=0.00729 (USD); Packaging: Cut Tape (CT); Tolerance: ±1%; Composition: Thick Film; Features: Automotive AEC-Q200; Operating Temperature: -55°C ~ 155°C; Package / Case: 0805 (2012 Metric); Supplier Device Package: 0805; Size / Dimension: 0.079" L x 0.049" W (2.00mm x 1.25mm); Height: 0.028" (0.70mm); Number of Terminations: 2; ComponentLink1URL: http://industrial.panasonic.com/www-cgi/jvcr13pz.cgi?E+PZ+3+AOA0002+ERJ6ENF2873V+7+WW; ComponentLink1Description: http://industrial.panasonic.com/www-cgi/jvcr13pz.cgi?E+PZ+3+AOA0002+ERJ6ENF2873V+7+WW
R55 = RES-0805/±1%: RES SMD 36K OHM 1% 1/8W 0805; Manufacturer: Panasonic Electronic Components; Manufacturer Part Number: ERJ-6ENF3602V; Power (Watts): 0.125W, 1/8W; Temperature Coefficient: ±100ppm/°C; Supplier 1: Digi-Key; Supplier Part Number 1: P36.0KCCT-ND; RoHS: RoHS Compliant; Category: Resistors; Stock 1: 24347; Pricing 1: 1=0.1, 50=0.022, 100=0.0162, 250=0.01236, 500=0.0099, 1000=0.00729 (USD); Packaging: Cut Tape (CT); Tolerance: ±1%; Composition: Thick Film; Features: Automotive AEC-Q200; Operating Temperature: -55°C ~ 155°C; Package / Case: 0805 (2012 Metric); Supplier Device Package: 0805; Size / Dimension: 0.079" L x 0.049" W (2.00mm x 1.25mm); Height: 0.028" (0.70mm); Number of Terminations: 2; ComponentLink1URL: http://industrial.panasonic.com/www-cgi/jvcr13pz.cgi?E+PZ+3+AOA0002+ERJ6ENF3602V+7+WW; ComponentLink1Description: http://industrial.panasonic.com/www-cgi/jvcr13pz.cgi?E+PZ+3+AOA0002+ERJ6ENF3602V+7+WW
SB1-SB3 = Connector-SB: Jumper, Connector, 2-pad; Value: Not a component
SW6 = SW-ROCKER/SPST/16A: SWITCH ROCKER SPST 16A 125V; Manufacturer: TE Connectivity Alcoswitch Switches; Manufacturer Part Number: PRASA1-16F-BB0BW; Switch Function: On-Off; Current Rating: 16A (AC); Actuator Type: Concave (Curved); Color - Actuator/Cap: Black; Actuator Marking: O -; Ingress Protection: Dust Proof; Mechanical Life: 100,000 Cycles; Electrical Life: 6,000 Cycles; Supplier 1: Digi-Key; RoHS: RoHS Compliant; Category: Switches; Stock 1: 2634; Pricing 1: 1=0.93, 10=0.786, 25=0.7788, 50=0.773 (USD); Packaging: Bulk; Circuit: SPST; Voltage Rating - AC: 125V; Voltage Rating - DC: -; Illumination Type, Color: -; Illumination Voltage (Nominal): -; Mounting Type: Panel Mount, Snap-In; Termination Style: Quick Connect - 0.187" (4.7mm); Features: -; Panel Cutout Dimensions: Rectangular - 19.20mm x 13.00mm; Operating Temperature: -20°C ~ 85°C; ComponentLink1URL: http://www.te.com/commerce/DocumentDelivery/DDEController?Action=srchrtrv&DocNm=1571076&DocType=Customer+Drawing&DocLang=English; ComponentLink1Description: http://www.te.com/commerce/DocumentDelivery/DDEController?Action=srchrtrv&DocNm=1571076&DocType=Customer+Drawing&DocLang=English; Supplier Part Number 1: 450-1810-ND
TB1 = TERM/3.81MM/4POS/GREEN: TERM BLOCK 4POS 3.81MM PCB GRN; Manufacturer: Phoenix Contact; Manufacturer Part Number: 1727036; Number of Levels: 1; Positions Per Level: 4; Pitch: 0.150" (3.81mm); Mating Orientation: Horizontal with Board; Current: 13.5A; Voltage: 300V; Wire Gauge: 16-30 AWG; Wire Termination: Screw - Rising Cage Clamp; Torque - Screw: 0.22-0.25 Nm (1.9-2.2 Lb-In); Screw Thread: M2; Supplier 1: Digi-Key; RoHS: RoHS Compliant; Category: Connectors, Interconnects; Stock 1: 1162; Pricing 1: 1=2.33, 10=2.229, 50=2.1318, 100=2.0737, 250=1.938, 500=1.78296, 1000=1.615, 2500=1.539, 5000=1.444 (USD); Packaging: Bulk; Mounting Type: Through Hole; Features: -; Color: Green; Operating Temperature: -; Housing Material: Polyamide (PA), Nylon; Contact Material - Plating: -; Clamp Material - Plating: -; Screw Material - Plating: -; ComponentLink1URL: http://media.digikey.com/pdf/Data%20Sheets/Phoenix%20Contact%20PDFs/1727036.pdf; ComponentLink1Description: http://media.digikey.com/pdf/Data%20Sheets/Phoenix%20Contact%20PDFs/1727036.pdf; Supplier Part Number 1: 277-1949-ND
TB2 = TERM/3.81MM/2POS/GREEN: TERM BLOCK 2POS 3.81MM PCB GRN; Manufacturer: Phoenix Contact; Manufacturer Part Number: 1727010; Number of Levels: 1; Positions Per Level: 2; Pitch: 0.150" (3.81mm); Mating Orientation: Horizontal with Board; Current: 13.5A; Voltage: 300V; Wire Gauge: 16-30 AWG; Wire Termination: Screw - Rising Cage Clamp; Torque - Screw: 0.22-0.25 Nm (1.9-2.2 Lb-In); Screw Thread: M2; Supplier 1: Digi-Key; RoHS: RoHS Compliant; Category: Connectors, Interconnects; Stock 1: 5625; Pricing 1: 1=1.14, 10=1.093, 50=1.045, 100=1.0165, 250=0.95, 500=0.874, 1000=0.8075, 2500=0.7695, 5000=0.722 (USD); Packaging: Bulk; Mounting Type: Through Hole; Features: -; Color: Green; Operating Temperature: -; Housing Material: Polyamide (PA), Nylon; Contact Material - Plating: -; Clamp Material - Plating: -; Screw Material - Plating: -; ComponentLink1URL: http://media.digikey.com/pdf/Data%20Sheets/Phoenix%20Contact%20PDFs/1727010.pdf; ComponentLink1Description: http://media.digikey.com/pdf/Data%20Sheets/Phoenix%20Contact%20PDFs/1727010.pdf; Supplier Part Number 1: 277-1947-ND
TP3-TP7 = Connector-TP: Test Point, Pad, Hole; Value: Not a component